# EasyEDA schematic PPG Foot Module.json
TITLE: PPG Module; REV: 1.0; Date: 2020-01-23; Sheet: 1/1; Drawn By: Christopher J. Kosik; Company: WMU CASSS
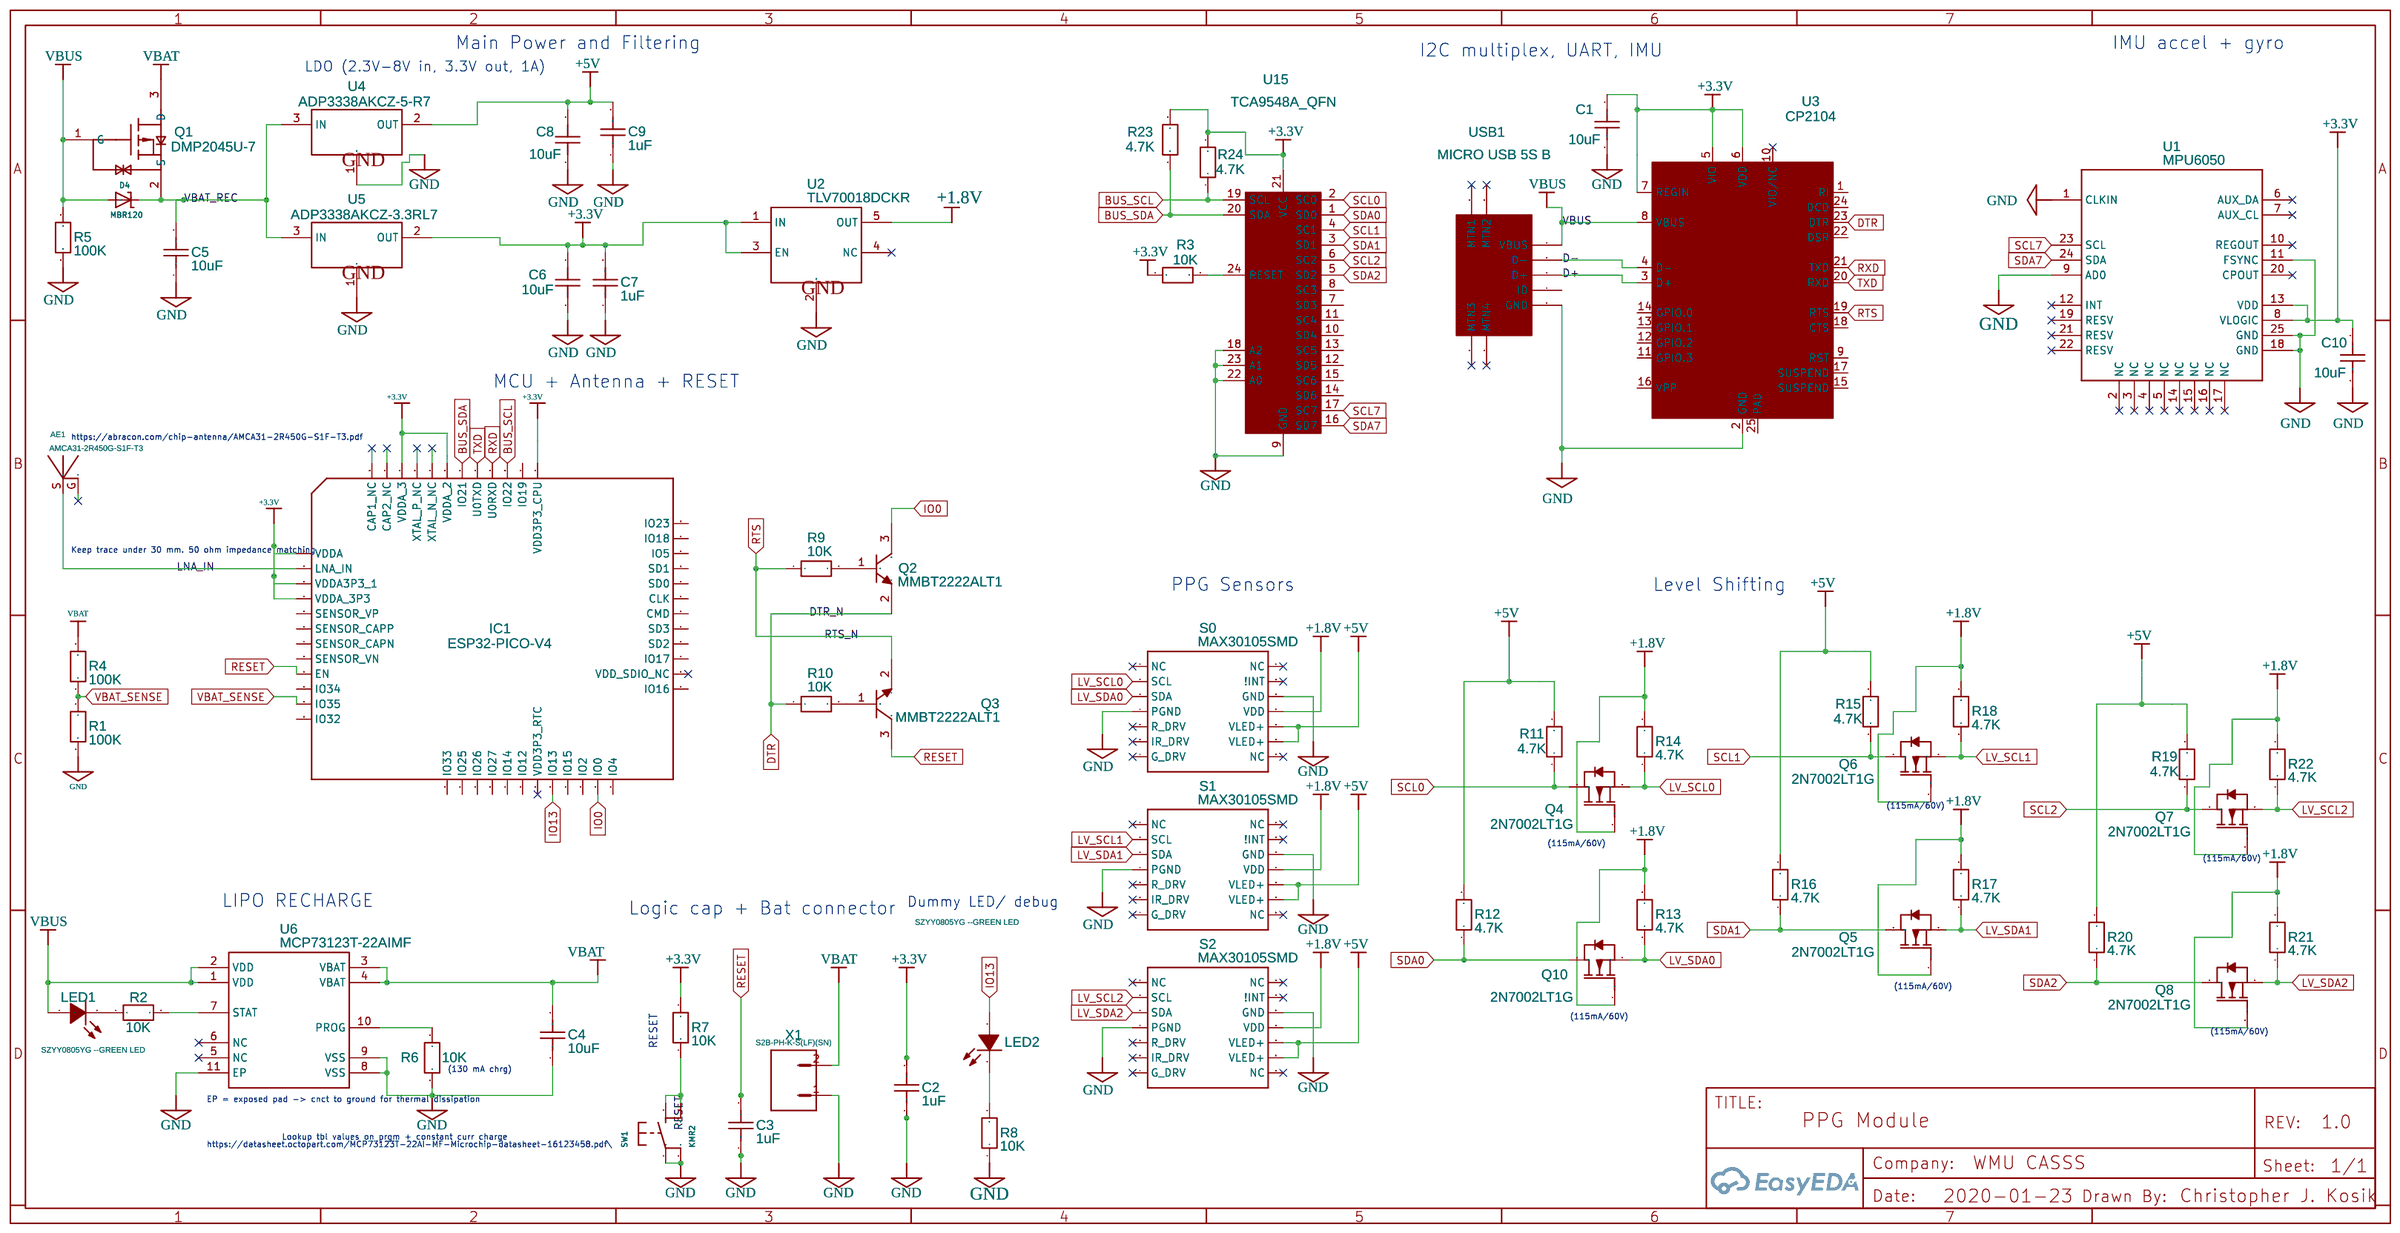
[diagram p0: schematic sheet]

## Parts
AE1  AMCA31-2R450G-S1F-T3  [AMCA31-2R450G-S1F-T3.PACK]
C1  10uF  [C0805]
C2  1uF  [C0402]
C3  1uF  [C0402]
C4  10uF  [C0805]
C5  10uF  [C0805]
C6  10uF  [C0805]
C7  1uF  [C0402]
C8  10uF  [C0805]
C9  1uF  [C0402]
C10  10uF  [C0805]
D4  MBR120  [SOD-123HE_L2.8-W1.8-LS3.7-RD]
IC1  ESP32-PICO-V4  [QFN48]
LED1  SZYY0805YG --GREEN LED  [LED0805-R-RD]
LED2  SZYY0805YG --GREEN LED  [LED0805-R-RD]
Q1  DMP2045U-7  [SOT-23F]
Q2  MMBT2222ALT1  [SOT23-3]
Q3  MMBT2222ALT1  [SOT23-3]
Q4  2N7002LT1G  [SOT-23_L2.9-W1.3-P0.95-LS2.4-BR]
Q5  2N7002LT1G  [SOT-23_L2.9-W1.3-P0.95-LS2.4-BR]
Q6  2N7002LT1G  [SOT-23_L2.9-W1.3-P0.95-LS2.4-BR]
Q7  2N7002LT1G  [SOT-23_L2.9-W1.3-P0.95-LS2.4-BR]
Q8  2N7002LT1G  [SOT-23_L2.9-W1.3-P0.95-LS2.4-BR]
Q10  2N7002LT1G  [SOT-23_L2.9-W1.3-P0.95-LS2.4-BR]
R1  100K  [R0603]
R2  10K  [R0603]
R3  10K  [R0603]
R4  100K  [R0603]
R5  100K  [R0603]
R6  10K  [R0603]
R7  10K  [R0603]
R8  10K  [R0603]
R9  10K  [R0603]
R10  10K  [R0603]
R11  4.7K  [R0603]
R12  4.7K  [R0603]
R13  4.7K  [R0603]
R14  4.7K  [R0603]
R15  4.7K  [R0603]
R16  4.7K  [R0603]
R17  4.7K  [R0603]
R18  4.7K  [R0603]
R19  4.7K  [R0603]
R20  4.7K  [R0603]
R21  4.7K  [R0603]
R22  4.7K  [R0603]
R23  4.7K  [R0603]
R24  4.7K  [R0603]
S0  MAX30105SMD  [OLGA-14]
S1  MAX30105SMD  [OLGA-14]
S2  MAX30105SMD  [OLGA-14]
SW1  KMR2  [BTN_KMR2_4.6X2.8]
U1  MPU6050  [QFN50P400X400X95-25T265X275N]
U2  TLV70018DCKR  [SC70]
U3  CP2104  [QFN-24-1EP_4X4MM_PITCH0.5MM]
U4  ADP3338AKCZ-5-R7  [SOT-223]
U5  ADP3338AKCZ-3.3RL7  [SOT-223]
U6  MCP73123T-22AIMF  [DFN-MF10]
U15  TCA9548A_QFN  [QFN-24-1EP_4X4MM_PITCH0.5MM]
USB1  MICRO USB 5S B  [MICRO-USB-1]
X1  S2B-PH-K-S(LF)(SN)  [S2B-PH-K-S(LF)(SN)]

## Library data of the parts
AE1 = AMCA31-2R450G-S1F-T3: Supplier Part: 535-14095-1-ND; Supplier: Digi-Key; link: https://www.digikey.com/product-detail/en/abracon-llc/AMCA31-2R450G-S1F-T3/535-14095-1-ND/7251446; Contributor: frappeyum
C1 C4-C6 C8 C10 = GJ821BR61E106KE11L: Supplier: LCSC; Supplier Part: C471371; Manufacturer: Murata Electronics; Contributor: LCSC
C2 C3 C7 C9 = C0402X5R105M6R3NT: Supplier: LCSC; Supplier Part: C475247; Manufacturer: SANYEAR; Contributor: LCSC
IC1 = CY8C29666_QFN48: Contributor: Senior Design 4820: PPG GODHOOD; subpart_no: 1
LED1 LED2 = SZYY0805YG --GREEN LED: Supplier: LCSC; Supplier Part: C434435; Manufacturer: Yongyu Photoelectric; Manufacturer Part: SZYY0805YG; Contributor: LCSC
Q1 = DMP2045U-7: Supplier: Digi-Key; Manufacturer: Diodes Inc; Contributor: LCSC; Supplier Part: C146276
Q2 Q3 = MMBT2222ALT1: General Purpose Transistor, NPN Silicon, 3-Pin SOT-23, Tape and Reel
Q4-Q8 Q10 = 2N7002LT1G: Supplier: LCSC; Manufacturer: ON; image: //image.lceda.cn/szlcsc/C16338.jpg; Supplier Part: C16338; LCSC Assembly: Yes; SMT Type: Extend
R1 R4 R5 = RAT031003FTP --100K: Supplier: LCSC; Supplier Part: C304472; Manufacturer: RALEC; Manufacturer Part: RAT031003FTP; Contributor: LCSC
R2 R3 R6-R10 = CR-03JA7---10K: Supplier: LCSC; Supplier Part: C465463; Manufacturer: Viking Tech; Contributor: LCSC
R11-R24 = ERJP03J472V --4.7K: Supplier: LCSC; Supplier Part: C427275; Manufacturer: PANASONIC; Manufacturer Part: ERJP03J472V; Contributor: LCSC
S0-S2 = MAX30105SMD: Contributor: Chris Kosik
U1 = MPU6050
U2 = TLV70018DCKR: Single Output LDO, 200 mA, Fixed 1.8 V Output, 2 to 5.5 V Input, with Low IQ, 5-pin SC70 (DCK), -40 to 125 degC, Green (RoHS  no SbBr)
U3 = CP2104: Contributor: KiCAD; license: https://www.gnu.org/licenses/lgpl-2.1.html
U4 = ADP3338AKCZ-5-R7: High Accuracy, Ultralow IQ, 1 A, anyCAP(R) Low Dropout Regulator, 2.7 to 8 V Vin, 5 V Vout, Industrial, 3-pin SOT223 (KC-3), Reel
U5 = ADP3338AKCZ-3.3RL7: High Accuracy, Ultralow IQ, 1 A, anyCAP(R) Low Dropout Regulator, 2.7 to 8 V Vin, 3.3 V Vout, Industrial, 3-pin SOT223 (KC-3), Reel
U6 = MCP73123T-22AIMF: Lithium Iron Phosphate (LiFePO4) Battery Charge Management Controller with Input OVP, 6.5V, 10-Pin DFN, Industrial Temperature, Tape and Reel
U15 = TCA9548A_QFN: Contributor: KiCAD; license: https://www.gnu.org/licenses/lgpl-2.1.html
USB1 = MICRO USB 5S B: Supplier Part: C10418; Supplier: LCSC; Manufacturer: ValuePro; Manufacturer Part: micro USBFemale
X1 = S2B-PH-K-S(LF)(SN): http:octopart.coms2b-ph-k-s%28lf%29%28sn%29-jst-248883

## Nets
+1.8V: Q4.1(G) Q5.1(G) Q6.1(G) Q7.1(G) Q8.1(G) Q10.1(G) R13.2 R14.2 R17.2 R18.2 R21.2 R22.2 S0.11(VDD) S1.11(VDD) S2.11(VDD) U2.5(OUT)
+3.3V: C1.1 C2.2 C6.1 C7.2 C10.1 IC1.1(VDDA) IC1.3(VDDA3P3_1) IC1.4(VDDA_3P3) IC1.37(VDD3P3_CPU) IC1.43(VDDA_2) IC1.46(VDDA_3) R3.1 R7.2 R23.2 R24.2 U1.8(VLOGIC) U1.13(VDD) U2.1(IN) U2.3(EN) U3.5(VIO) U3.6(VDD) U3.7(REGIN) U5.2(OUT) U15.21(VCC)
+5V: C8.2 C9.2 R11.2 R12.2 R15.2 R16.2 R19.2 R20.2 S0.9(VLED+) S0.10(VLED+) S1.9(VLED+) S1.10(VLED+) S2.9(VLED+) S2.10(VLED+) U4.2(OUT)
GND: C1.2 C2.1 C3.1 C4.1 C5.1 C6.2 C7.1 C8.1 C9.1 C10.2 R1.1 R5.1 R6.1 R8.1 S0.4(PGND) S0.12(GND) S1.4(PGND) S1.12(GND) S2.4(PGND) S2.12(GND) SW1.A(P) SW1.A'(P1) U1.1(CLKIN) U1.9(AD0) U1.11(FSYNC) U1.18(GND) U1.25(GND) U2.2(GND) U3.2(GND) U4.1(GND) U5.1(GND) U6.8(VSS) U6.9(VSS) U6.11(EP) U15.9(GND) U15.18(A2) U15.22(A0) U15.23(A1) USB1.5(GND) X1.1
VBAT: C4.2 Q1.3(D) R4.2 U6.3(VBAT) U6.4(VBAT) X1.2
VBAT_REC: C5.2 D4.2(C) Q1.2(S) U4.3(IN) U5.3(IN)
VBAT_SENSE: IC1.11(IO35) R1.2 R4.1
VBUS: D4.1(A) LED1.1(+) Q1.1(G) R5.2 U3.8(VBUS) U6.1(VDD) U6.2(VDD) USB1.1(VBUS)
BUS_SCL: IC1.39(IO22) R24.1 U15.19(SCL)
BUS_SDA: IC1.42(IO21) R23.1 U15.20(SDA)
D+: U3.3(D+) USB1.3(D+)
D-: U3.4(D-) USB1.2(D-)
DTR: Q2.2(E) R10.1 U3.23(DTR)
IO0: IC1.23(IO0) Q2.3(C)
IO13: IC1.20(IO13) LED2.1(+)
LNA_IN: AE1.S IC1.2(LNA_IN)
LV_SCL0: Q4.2(S) R14.1 S0.2(SCL)
LV_SCL1: Q6.2(S) R18.1 S1.2(SCL)
LV_SCL2: Q7.2(S) R22.1 S2.2(SCL)
LV_SDA0: Q10.2(S) R13.1 S0.3(SDA)
LV_SDA1: Q5.2(S) R17.1 S1.3(SDA)
LV_SDA2: Q8.2(S) R21.1 S2.3(SDA)
RESET: C3.2 IC1.9(EN) Q3.3(C) R7.1 SW1.B(S) SW1.B'(S1)
RTS: Q3.2(E) R9.1 U3.19(RTS)
RXD: IC1.40(U0RXD) U3.21(TXD)
SCL0: Q4.3(D) R11.1 U15.2(SC0)
SCL1: Q6.3(D) R15.1 U15.4(SC1)
SCL2: Q7.3(D) R19.1 U15.6(SC2)
SCL7: U1.23(SCL) U15.17(SC7)
SDA0: Q10.3(D) R12.1 U15.1(SD0)
SDA1: Q5.3(D) R16.1 U15.3(SD1)
SDA2: Q8.3(D) R20.1 U15.5(SD2)
SDA7: U1.24(SDA) U15.16(SD7)
TXD: IC1.41(U0TXD) U3.20(RXD)
Net-(LED1-2): LED1.2(-) R2.1
Net-(LED2-2): LED2.2(-) R8.2
Net-(Q2-1): Q2.1(B) R9.2
Net-(Q3-1): Q3.1(B) R10.2
Net-(R2-2): R2.2 U6.7(STAT)
Net-(R3-2): R3.2 U15.24(RESET)
Net-(R6-2): R6.2 U6.10(PROG)

Not connected (* = marked no-connect by the designer): AE1 G; IC1 5(SENSOR_VP) 6(SENSOR_CAPP) 7(SENSOR_CAPN) 8(SENSOR_VN) 10(IO34) 12(IO32) 13(IO33) 14(IO25) 15(IO26) 16(IO27) 17(IO14) 18(IO12) 19(VDD3P3_RTC)* 21(IO15) 22(IO2) 24(IO4) 25(IO16) 26(VDD_SDIO_NC)* 27(IO17) 28(SD2) 29(SD3) 30(CMD) 31(CLK) 32(SD0) 33(SD1) 34(IO5) 35(IO18) 36(IO23) 38(IO19) 44(XTAL_N_NC) 45(XTAL_P_NC) 47(CAP2_NC) 48(CAP1_NC); S0 1(NC)* 5(R_DRV)* 6(IR_DRV)* 7(G_DRV)* 8(NC)* 13(!INT)* 14(NC)*; S1 1(NC)* 5(R_DRV)* 6(IR_DRV)* 7(G_DRV)* 8(NC)* 13(!INT)* 14(NC)*; S2 1(NC)* 5(R_DRV)* 6(IR_DRV)* 7(G_DRV)* 8(NC)* 13(!INT)* 14(NC)*; U1 2(NC)* 3(NC)* 4(NC)* 5(NC)* 6(AUX_DA)* 7(AUX_CL)* 10(REGOUT)* 12(INT)* 14(NC)* 15(NC)* 16(NC)* 17(NC)* 19(RESV)* 20(CPOUT)* 21(RESV)* 22(RESV)*; U2 4(NC)*; U3 1(RI) 9(RST) 10(VIO/NC)* 11(GPIO.3) 12(GPIO.2) 13(GPIO.1) 14(GPIO.0) 15(SUSPEND) 16(VPP) 17(SUSPEND) 18(CTS) 22(DSR) 24(DCD) 25(PAD); U6 5(NC)* 6(NC)*; U15 7(SD3) 8(SC3) 10(SD4) 11(SC4) 12(SD5) 13(SC5) 14(SD6) 15(SC6); USB1 0(MTN1)* 4(ID)

## Notes on the sheet
- Main Power and Filtering
- IMU accel + gyro
- I2C multiplex, UART, IMU
- LDO (2.3V-8V in, 3.3V out, 1A)
- MCU + Antenna + RESET
- https://abracon.com/chip-antenna/AMCA31-2R450G-S1F-T3.pdf
- Keep trace under 30 mm. 50 ohm impedance matching
- PPG Sensors
- Level Shifting
- (115mA/60V)
- (115mA/60V)
- (115mA/60V)
- LIPO RECHARGE
- Logic cap + Bat connector
- Dummy LED/ debug
- (115mA/60V)
- (115mA/60V)
- (115mA/60V)
- RESET
- (130 mA chrg)
- EP = exposed pad -> cnct to ground for thermal dissipation
- Lookup tbl values on prgm + constant curr charge
- https://datasheet.octopart.com/MCP73123T-22AI-MF-Microchip-datasheet-16123458.pdf\
